# EAGLE design femtoduinoUSB (EAGLE 6.5.0)
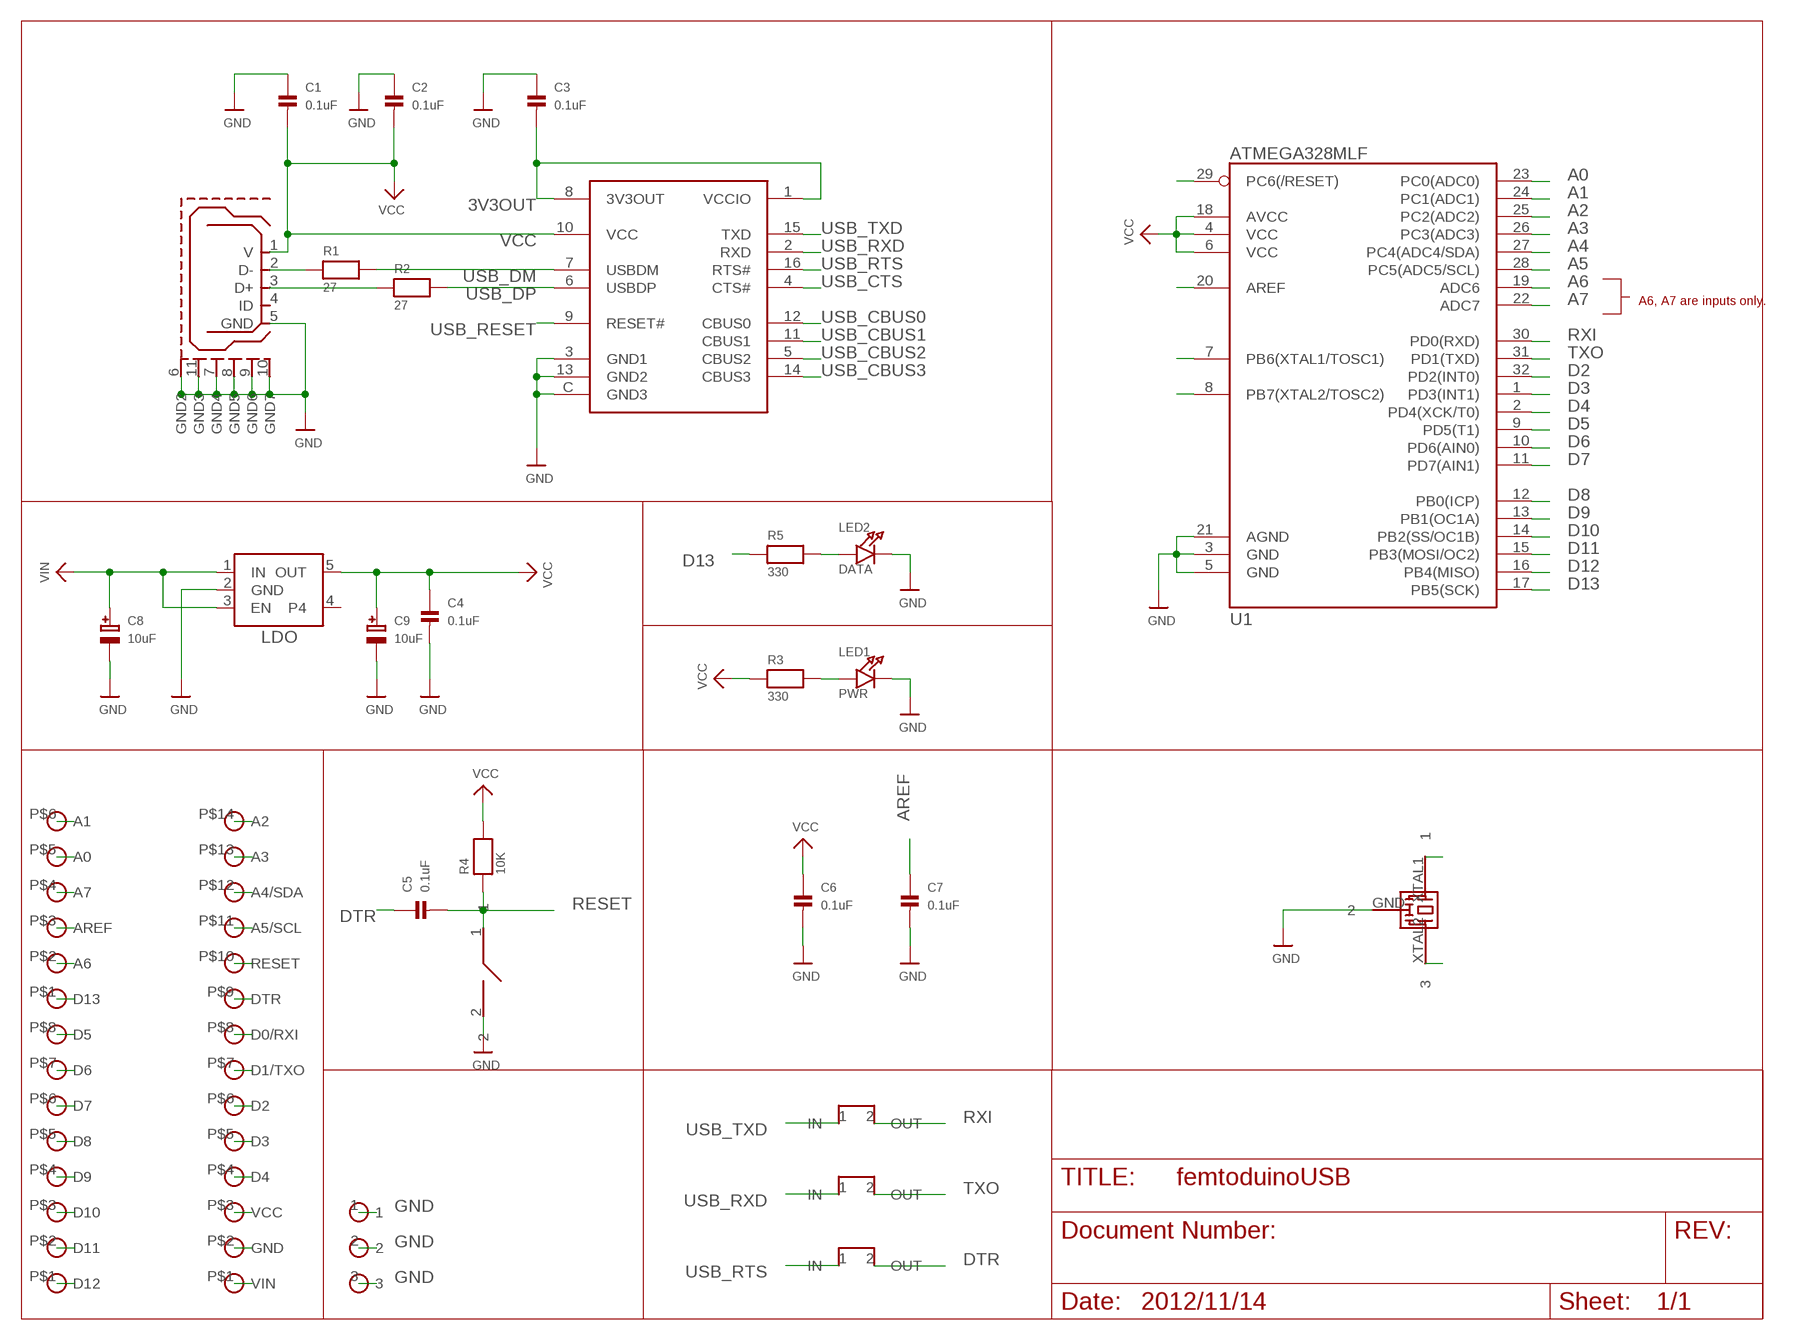
[diagram p0: schematic, sheet 1]
FRAME1 (LETTER_L): LAST_DATE_TIME: 2012/11/14

## Parts
C1  0.1uF  CAP_CERAMIC_0402  [_0402]
C2  0.1uF  CAP_CERAMIC_0402  [_0402]
C3  0.1uF  CAP_CERAMIC_0402  [_0402]
C4  0.1uF  CAP_CERAMIC_0402MP  [_0402MP]
C5  0.1uF  CAP_CERAMIC_0402MP  [_0402MP]
C6  0.1uF  CAP_CERAMIC_0402MP  [_0402MP]
C7  0.1uF  CAP_CERAMIC_0402  [_0402]
C8  10uF  CAP_TANTALUMA/3216_REFLOW  [EIA3216-18/A-R]
C9  10uF  CAP_TANTALUMA/3216_REFLOW  [EIA3216-18/A-R]
LED1  PWR  LED0603_NOOUTLINE  [CHIPLED_0603_NOOUTLINE]
LED2  DATA  LED0603_NOOUTLINE  [CHIPLED_0603_NOOUTLINE]
R1  27  RESISTOR_0402  [_0402]
R2  27  RESISTOR_0402  [_0402]
R3  330  RESISTOR_0402MP  [_0402MP]
R4  10K  RESISTOR_0402  [_0402]
R5  330  RESISTOR_0402  [_0402]
U1  ATMEGA328MLF  ATMEGA168MLF  [MLF32]
U$1  FT230XQ  [FT230XQ]
U$2  05_PINHEAD_1X6  [05_PINHEAD_1X6_PACKAGE]
U$3  05_PINHEAD_1X8  [05_PINHEAD_1X8_PACKAGE]
U$4  05_PINHEAD_1X14  [05_PINHEAD_1X14_PACKAGE]
U$6  USB_MICROB  [USB_MICROB_PACKAGE]
U$10  LDO_REGULATOR  [LDO_REGULATOR]
U$17  SPST_SMD  [SPST_SMD]
U$22  CSTCE16MOV51-RO  [CSTCE16M0V51-RO_PACKAGE]
U$25  SPST_SMD_CLOSED  [SPST_SMD_CLOSED]
U$26  SPST_SMD_CLOSED  [SPST_SMD_CLOSED]
U$27  SPST_SMD_CLOSED  [SPST_SMD_CLOSED]
U$28  05_PINHEAD_HEADER_1X3  [05_PINHEAD_1X3_HEAD_PACKAGE]

## Nets
3V3OUT: C3.2 U$1.1(VCCIO) U$1.8(3V3OUT)
A0: U1.23(PC0(ADC0)) U$2.P$5(A0)
A1: U1.24(PC1(ADC1)) U$2.P$6(A1)
A2: U1.25(PC2(ADC2)) U$4.P$14(A2)
A3: U1.26(PC3(ADC3)) U$4.P$13(A3)
A4: U1.27(PC4(ADC4/SDA)) U$4.P$12(A4/SDA)
A5: U1.28(PC5(ADC5/SCL)) U$4.P$11(A5/SCL)
A6: U1.19(ADC6) U$2.P$2(A6)
A7: U1.22(ADC7) U$2.P$4(A7)
AREF: C7.1 U1.20(AREF) U$2.P$3(AREF)
D2: U1.32(PD2(INT0)) U$4.P$6(D2)
D3: U1.1(PD3(INT1)) U$4.P$5(D3)
D4: U1.2(PD4(XCK/T0)) U$4.P$4(D4)
D5: U1.9(PD5(T1)) U$3.P$8(D5)
D6: U1.10(PD6(AIN0)) U$3.P$7(D6)
D7: U1.11(PD7(AIN1)) U$3.P$6(D7)
D8: U1.12(PB0(ICP)) U$3.P$5(D8)
D9: U1.13(PB1(OC1A)) U$3.P$4(D9)
D10: U1.14(PB2(SS/OC1B)) U$3.P$3(D10)
D11: U1.15(PB3(MOSI/OC2)) U$3.P$2(D11)
D12: U1.16(PB4(MISO)) U$3.P$1(D12)
D13: R5.1 U1.17(PB5(SCK)) U$2.P$1(D13)
DTR: C5.1 U$4.P$9(DTR) U$27.2(OUT)
GND: C1.1 C2.1 C3.1 C4.2 C6.2 C7.2 C8.- C9.- LED1.C LED2.C U1.3(GND) U1.5(GND) U1.21(AGND) U$1.3(GND1) U$1.13(GND2) U$1.C(GND3) U$4.P$2(GND) U$6.5(GND) U$6.6(GND2) U$6.7(GND4) U$6.8(GND5) U$6.9(GND6) U$6.10(GND7) U$6.11(GND3) U$10.2(GND) U$17.2 U$22.GND U$28.1 U$28.2 U$28.3
N$1: R1.1 U$6.2(D-)
N$2: R2.1 U$6.3(D+)
N$3: LED2.A R5.2
N$8: LED1.A R3.2
RESET: C5.2 R4.1 U1.29(PC6(/RESET)) U$4.P$10(RESET) U$17.1
RXI: U1.30(PD0(RXD)) U$4.P$8(D0/RXI) U$25.2(OUT)
TXO: U1.31(PD1(TXD)) U$4.P$7(D1/TXO) U$26.2(OUT)
USB_CBUS0: U$1.12(CBUS0)
USB_CBUS1: U$1.11(CBUS1)
USB_CBUS2: U$1.5(CBUS2)
USB_CBUS3: U$1.14(CBUS3)
USB_CTS: U$1.4(CTS#)
USB_DM: R1.2 U$1.7(USBDM)
USB_DP: R2.2 U$1.6(USBDP)
USB_RESET: U$1.9(RESET#)
USB_RTS: U$1.16(RTS#) U$27.1(IN)
USB_RXD: U$1.2(RXD) U$26.1(IN)
USB_TXD: U$1.15(TXD) U$25.1(IN)
VCC: C1.2 C2.2 C4.1 C6.1 C9.+ R3.1 R4.2 U1.4(VCC) U1.6(VCC) U1.18(AVCC) U$1.10(VCC) U$4.P$3(VCC) U$6.1(V) U$10.5(OUT)
VIN: C8.+ U$4.P$1(VIN) U$10.1(IN) U$10.3(EN)
XTAL1: U1.7(PB6(XTAL1/TOSC1)) U$22.XTAL1
XTAL2: U1.8(PB7(XTAL2/TOSC2)) U$22.XTAL2
Unconnected: U$6.4(ID) U$10.4

## Notes on the sheet
- A6, A7 are inputs only.

## Library data of the parts
C1-C7 = microbuilder:CAP_CERAMIC: Ceramic Capacitors 0402 - 0402 Surface Mount Capacitors 16pF 50V 5% [Digikey: 445-4899-2-ND] 18pF 50V 5% [Digikey: 490-1281-2-ND] 22pF 50V 5% [Digikey: 490-1283-2-ND] 68pF 50V 5% [Digikey: 490-1289-2-ND] 0.1uF 10V 10% [Digikey: 490-1318-2-ND] 1.0uF 6.3V 10% [Digikey: 490-1320-2-ND] 0603 - 0603 Surface Mount Capacitors 16 pF 50V 5% [Digikey: 445-5051-2-ND] 22 pF 50V [Digikey: PCC220ACVTR-ND] 33 pF 50V 5% [Digikey: 490-1415-1-ND] 56pF 50V 5% [Digikey: 490-1421-1-ND] 220pF 50V 5% [Digikey: 445-1285-1-ND] 680 pF 50V 2200 pF 50V 5% C0G [Digikey: 445-1297-1-ND] 5600 pF 100V 5% X7R [Digikey: 478-3711-1-ND] 0.1 µF 25V 10% [Digikey: PCC2277TR-ND] 0.22 µF 16V 10% X7R [Digikey: 445-1318-1-ND] 1.0 µF 25V 10% [Digikey: 445-5146-2-ND] 0603 - RF Specific 3pF 250V +/-0.1pF RF [Digikey: 712-1347-1-ND] 18 pF 250V 5% [Digikey: 478-3505-1-ND or 712-1322-1-ND] 56 pF 250V 5% C0G RF [Digikey: 490-4867-1-ND] 68 pF 250V RF [Digikey: 490-4868-1-ND] 0805 - 0805 Surface Mount Capacitors 220 pF 250V 2% RF Ceramic Capacitor [Digikey: 712-1398-1-ND] 1000 pF 50V 2% NP0 Ceramic Capacitor [Digikey: 478-3760-1-ND] 0.1 µF 25V 10% Ceramic Capacitor [Digikey: PCC1828TR-ND] 1.0 µF 16V 10% Ceramic Capacitor[Digikey: 490-1691-2-ND] 10.0 µF 10V 10% Ceramic Capacitor[Digikey: 709-1228-1-ND] 10.0 uF 16V 10% Ceramic Capacitor [Digikey: 478-5165-2-ND] 47 uF 6.3V 20% Ceramic Capacitor [Digikey: 587-1779-1-ND or 399-5506-1-ND] 1206 - 1206 Surface Mount Capacitors 47uF 10V 20% Ceramic Capacitor [Digikey: 490-5528-1-ND or 399-5508-1-ND or 445-6010-1-ND] 100uF 6.3V -20%, +80% Y5V Ceramic Capacitor (Digikey: 490-4512-1-ND, Mouser: 81-GRM31CF50J107ZE1L)
C8 C9 = microbuilder:CAP_TANTALUM: Tantalum Capacitors Wave footprints have larger pads and are meant to be used for hand soldering. Reflow footprints are optimised for solder paste and a reflow oven. EIA3216-18/A-[R/W] - Size A / 3216-18 / 1206 footprint 4.7µF 25V 10% Tantalum Capacitor 10µF 16V 10% Tantalum Capacitor [Digikey: 495-2236-2-ND] EIA3528-21/B-[R/W] - Size B / 3528-21 47µF 10V 10% Tantalum Capactior [Digikey: 495-2216-1-ND] EIA6032-28/C-[R/W] - Size C / 6032-28 10µF 35V 20% Tantalum Capacitor [Digikey: 495-2285-1-ND] 100µF 16V 10% Tantalum Capactior [Digikey: 399-5214-1-ND]
LED1 LED2 = microbuilder:LED: LED 0603 - 0603 Surface Mount Package 2mA: Green LED - Low Power (3.9mcd, 2ma, 1.7Vf) - Digikey: 475-2709-2-ND Orange LED - Low Power (9.8mcd, 2ma, 1.8Vf) - Digikey: 475-1194-2-ND Red LED - Low Power (5mcd, 2ma, 1.8Vf) - Digikey: 475-1195-2-ND Yellow LED - Low Power (7mcd, 2ma, 1.8Vf) - Digikey: 475-1196-2-ND 5mA: Blue LED - Low Power (17mcd, 5ma, 2.9Vf) - Digikey: LNJ937W8CRACT-ND 0805 - 0805 Surface Mount Package 2mA: Red LED (8.8mcd, 2mA, 1.8Vf, Clear) - Low Power [Digikey: 475-2510-1-ND] Green LED (5mcd, 2mA, 1.8Vf, Clear) - Low Power [Digikey: 475-2730-1-ND] Yellow LED (11.3mcd, 2mA, 1.8Vf, Clear) - Low Power [Digikey: 475-2555-1-ND] 20mA: Red LED (104mcd, 20mA, Diffused) - LS R976 [Digikey: 475-1278-6-ND] Red LED (12mcd, 20mA, 2.0Vf, Clear) - APT2012EC [Digikey: 754-1128-1-ND] Green LED (15mcd, 20mA, 2.2Vf, Clear) - APT2012GC [Digikey: 754-1131-1-ND] Orange LED (160mcd, 20mA, 2.1Vf, Clear) - APT2012SECK [Digikey: 754-1130-1-ND] 1206 - 1206 Surface Mount Package Green LED (26mcd, 20mA, Diffused) - LG N971 [Digikey: 475-1407-6-ND] Red LED (15mcd, 20mA, Diffused) - LH N974 [Digikey: 475-1416-6-ND]
R1-R5 = microbuilder:RESISTOR: Resistors 0402 - 0402 Surface Mount Package 22 Ohm 1% 1/16W [Digikey: 311-22.0LRTR-ND] 33 Ohm 5% 1/16W 1.0K 5% 1/16W 1.5K 5% 1/16W 2.0K 1% 1/16W 10.0K 1% 1/16W [Digikey: 311-10.0KLRTR-ND] 10.0K 5% 1/16W [Digikey: RMCF0402JT10K0TR-ND] 12.1K 1% 1/16W [Digikey: 311-22.0LRTR-ND] 100.0K 5% 1/16W 0603 - 0603 Surface Mount Package 0 Ohm 1/10 Watt 1% Resistor 15 Ohm 1/10 Watt 1% Resistor 33 Ohm 1/10 Watt 1% Resistor 49.9 Ohm 1/10 Watt 1% Resistor 100 Ohm 1/10 Watt 1% Resistor 150 Ohm 1/10 Watt 1% Resistor 240 Ohm 1/10 Watt 1% Resistor 390 Ohm 1/10 Watt 1% Resistor 560 Ohm 1/10 Watt 1% Resistor 680 Ohm 1/10 Watt 1% Resistor 750 Ohm 1/10 Watt 1% Resistor 1.0K Ohm 1/10 Watt 1% Resistor 1.5K Ohm 1/10 Watt 1% Resistor 2.0K Ohm 1/10 Watt 1% Resistor 2.2K Ohm 1/10 Watt 1% Resistor 3.3K Ohm 1/10 Watt 1% Resistor 4.7K Ohm 1/10 Watt 1% Resistor 10.0K Ohm 1/10 Watt 1% Resistor 12.0K Ohm 1/10 Watt 1% Resistor 12.1K Ohm 1/10 Watt 1% Resistor 20.0K Ohm 1/10 Watt 1% Resistor 33.0K Ohm 1/10 Watt 1% Resistor 100.0K Ohm 1/10 Watt 1% Resistor 0805 - 0805 Surface Mount Package 0 Ohm 1/8 Watt 1% Resistor 33 Ohm 1/8 Watt 1% Resistor 100 Ohm 1/8 Watt 1% Resistor 150 Ohm 1/8 Watt 1% Resistor 200 Ohm 1/8 Watt 1% Resistor 240 Ohm 1/8 Watt 1% Resistor 330 Ohm 1/8 Watt 1% Resistor 390 Ohm 1/8 Watt 1% Resistor 470 Ohm 1/8 Watt 1% Resistor 1.0K Ohm 1/8 Watt 1% Resistor 1.5K Ohm 1/8 Watt 1% Resistor 2.0K Ohm 1/8 Watt 1% Resistor 4.7K Ohm 1/8 Watt 1% Resistor 5.1K Ohm 1/8 Watt 1% Resistor 5.6K Ohm 1/8 Watt 1% Resistor 10.0K Ohm 1/8 Watt 1% Resistor 22.0K Ohm 1/8 Watt 1% Resistor 33.0K Ohm 1/8 Watt 1% Resistor 100K Ohm 1/8 Watt 1% Resistor 1206 - 1206 Surface Mount Package 2012 - 2010 Surface Mount Package 0.11 Ohm 1/2 Watt 1% Resistor - Digikey: RHM.11UCT-ND
U1 = SparkFun-DigitalIC:ATMEGA168: Atmel 32-pin 8-bit micro, 16k flash.
U$1 = femtoduino:FT230XQ
U$2 = femtoduino:05_PINHEAD_1X6
U$3 = femtoduino:05_PINHEAD_1X8
U$4 = femtoduino:05_PINHEAD_1X14
U$6 = femtoduino:USB_MICROB: This is the hirose ZX62-B-5PA(11) MICRO-USB B Type female connection.
U$10 = femtoduino:LDO_REGULATOR
U$17 = femtoduino:SPST_SMD
U$22 = femtoduino:CSTCE16MOV51-RO: This is the CSTCE16M0V51-R0 Murata resonator (CERALOCK) 16Mhz 0.5% Tolerance
U$25-U$27 = femtoduino:SPST_SMD_CLOSED
U$28 = femtoduino:05_PINHEAD_HEADER_1X3

## Net classes
0 default: clearance 0.205 mm

## Board
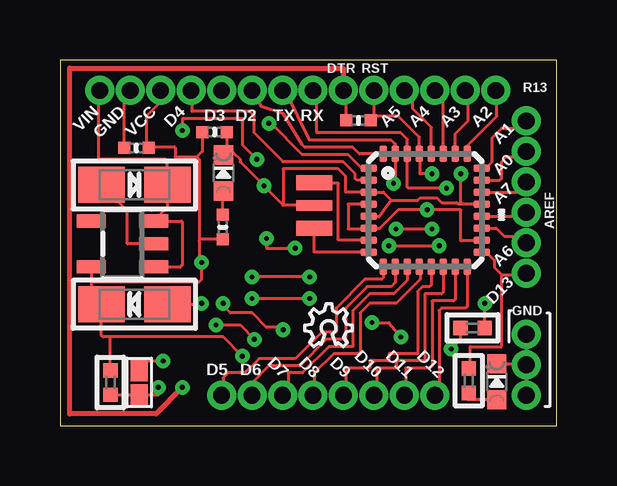
[diagram p1: board, top side]
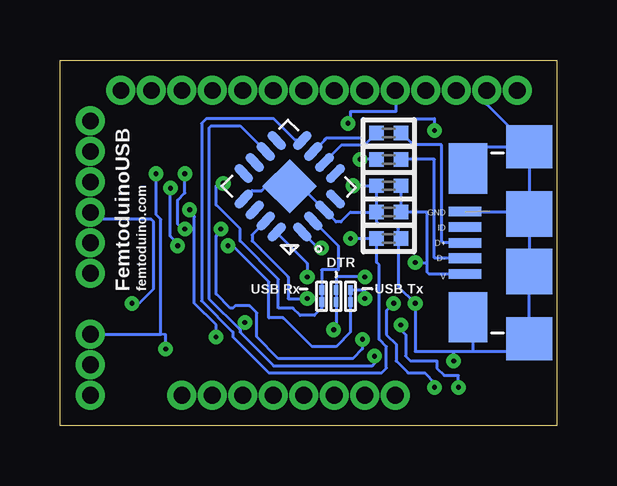
[diagram p2: board, bottom side, seen from below]

Size 20.7 x 15.24 mm. Coordinates in mm from the lower left corner, seen from the top.
Outline: 0,0 20.7,0 20.7,15.24 0,15.24 0,0
Copper layers (1*16): Top 0.035mm / dielectric 1.5mm / Bottom 0.035mm
Design rules "default *": minimum track width 10mil, minimum drill 24mil, track to track 8mil, track to pad 8mil, pad to pad 8mil, via to via 8mil, smd to smd 8mil, copper to edge 40mil, drill to drill 8mil, minimum pad ring 10mil, minimum via ring 8mil, stop-mask expansion 2mil, vias tented up to drill 30mil, thermal gap 10mil

### Footprints (pad centres in the part's own frame; a part is rotated, then mirrored left to right if it is on the bottom)
_0402 = smd 0.6 x 0.6: 1 -0.508,0; 2 0.508,0
_0402MP = smd 0.5 x 0.5: 1 -0.508,0; 2 0.508,0
EIA3216-18/A-R = smd 1.95 x 1.5: + 1.375,0; - -1.375,0
CHIPLED_0603_NOOUTLINE = smd 0.8 x 0.8: A 0,-0.75; C 0,0.75
MLF32 = smd 0.7 x 0.3: 1 -2.35,1.75; 2 -2.35,1.25; 3 -2.35,0.75; 4 -2.35,0.25; 5 -2.35,-0.25; 6 -2.35,-0.75; 7 -2.35,-1.25; 8 -2.35,-1.75; 17 2.35,-1.75; 18 2.35,-1.25; 19 2.35,-0.75; 20 2.35,-0.25; 21 2.35,0.25; 22 2.35,0.75; 23 2.35,1.25; 24 2.35,1.75 | smd 0.3 x 0.7: 9 -1.75,-2.35; 10 -1.25,-2.35; 11 -0.75,-2.35; 12 -0.25,-2.35; 13 0.25,-2.35; 14 0.75,-2.35; 15 1.25,-2.35; 16 1.75,-2.35; 25 1.75,2.35; 26 1.25,2.35; 27 0.75,2.35; 28 0.25,2.35; 29 -0.25,2.35; 30 -0.75,2.35; 31 -1.25,2.35; 32 -1.75,2.35
FT230XQ = smd 0.95 x 0.4: 1 -1.725,0.975; 2 -1.725,0.325; 3 -1.725,-0.325; 4 -1.725,-0.975; 9 1.725,-0.975; 10 1.725,-0.325; 11 1.725,0.325; 12 1.725,0.975 | smd 0.4 x 0.95: 5 -0.975,-1.725; 6 -0.325,-1.725; 7 0.325,-1.725; 8 0.975,-1.725; 13 0.975,1.725; 14 0.325,1.725; 15 -0.325,1.725; 16 -0.975,1.725 | smd 1.6 x 1.6: C 0,0
05_PINHEAD_1X6_PACKAGE = drill 0.7 pad 1.143: P$1 0,0; P$2 0,1.27; P$3 0,2.54; P$4 0,3.81; P$5 0,5.08; P$6 0,6.35
05_PINHEAD_1X8_PACKAGE = drill 0.7 pad 1.143: P$1 0,0; P$2 0,1.27; P$3 0,2.54; P$4 0,3.81; P$5 0,5.08; P$6 0,6.35; P$7 0,7.62; P$8 0,8.89
05_PINHEAD_1X14_PACKAGE = drill 0.7 pad 1.143: P$1 0,0; P$2 0,1.27; P$3 0,2.54; P$4 0,3.81; P$5 0,5.08; P$6 0,6.35; P$7 0,7.62; P$8 0,8.89; P$9 0,10.16; P$10 0,11.43; P$11 0,12.7; P$12 0,13.97; P$13 0,15.24; P$14 0,16.51
USB_MICROB_PACKAGE = smd 0.4 x 1.35: 1 -1.3,-0.68; 2 -0.64,-0.68; 3 0,-0.68; 4 0.66,-0.68; 5 1.3,-0.68 | smd 2.1 x 1.6: 6 -3.1,-0.8; 11 3.1,-0.8 | smd 1.8 x 1.9: 7 -4,-3.35; 10 4,-3.35 | smd 1.9 x 1.9: 8 -1.2,-3.35; 9 1.2,-3.35
LDO_REGULATOR = smd 0.55 x 1.2: 1 -0.95,-1.3; 2 0,-1.3; 3 0.95,-1.3; 4 0.95,1.3; 5 -0.95,1.3
SPST_SMD = smd 0.889 x 0.699: 1 -0.508,0; 2 0.508,0
CSTCE16M0V51-RO_PACKAGE = smd 1.5 x 0.45: GND 0,0.95 | smd 1.5 x 0.62: XTAL1 0,1.9; XTAL2 0,0
SPST_SMD_CLOSED = smd 0.4 x 0.2: 1 -0.25,0; 2 0.25,0
05_PINHEAD_1X3_HEAD_PACKAGE = drill 0.7 pad 1.016: 1 0,0; 2 0,-1.27; 3 0,-2.54

### Placement (x,y rotation side)
C1  7,10 0 bottom
C2  7,8.9 0 bottom
C3  7,7.8 180 bottom
C4  6.44,12.24 0 top
C5  12.43,12.72 0 top
C6  3.18,11.58 180 top
C7  17.19,4.08 180 top
C8  3.1,10.04 0 top
C9  3.1,5.06 180 top
LED1  6.81,10.53 0 top
LED2  18.2,1.83 0 top
R1  7,11.1 180 bottom
R2  7,12.2 180 bottom
R3  6.78,8.28 90 top
R4  2.1,1.8 90 top
R5  17.03,1.88 270 top
U1  15.22,8.98 0 top
U$1  11.14,9.98 135 bottom
U$2  19.43,6.35 0 top
U$3  15.62,1.27 90 top
U$4  1.65,13.97 270 top
U$6  4.5,7.62 90 bottom
U$10  2.6,7.58 90 top
U$17  3.3,1.8 90 top
U$22  10.59,8.23 0 top
U$25  8.6,5.4 270 bottom
U$26  9.8,5.4 270 bottom
U$27  9.2,5.4 270 bottom
U$28  19.43,1.27 180 top
U$29  [OSHW_6X70_NOTEXT]  10.2,3.3 0 top

### Tracks (layer width: path | path; a pad name or v marks a point on that pad's centre or on a via)
3V3OUT  (via drill 0.2 pad 0.13)
  Top 0.127: v8.6,7.8 8.6,7.4 v9.8,7.4
  Bottom 0.127: U$1.8 10.89,11.89 11.8,12.8 14.6,12.8 14.8,12.6 14.8,5.2 13.5,3.9 13.5,3.7 12,2.2 7.3,2.2 7.1,2.4 7.1,3.3 7.4,3.6 7.4,6.7 7.51,6.81 C3.2 | 10.61,7.99 U$1.1 9.93,7.4 v9.8,7.4 | C3.2 v8.6,7.8 | 7.61,7.61 C3.2
A0
  Top 0.127: U1.23 18.33,10.23 18.4,10.3 18.4,11 18.6,11.2 19.2,11.2 U$2.P$5
A1
  Top 0.127: U1.24 17.73,10.73 18,11 18,12 18.4,12.4 19.13,12.4 U$2.P$6
A2
  Top 0.127: U1.25 16.97,11.67 18.2,12.9 18.2,13.93 U$4.P$14
A3
  Top 0.127: U1.26 16.47,12.17 17,12.7 17,13.86 U$4.P$13
A4
  Top 0.127: U1.27 15.97,13.62 U$4.P$12
A5
  Top 0.127: U1.28 15.47,12.43 14.7,13.2 14.7,13.62 U$4.P$11
A6
  Top 0.127: U1.19 18.17,8.23 18.5,7.9 19.15,7.9 U$2.P$2
A7
  Top 0.127: U1.22 19,9.73 U$2.P$4
AREF  (via drill 0.2 pad 0.13)
  Top 0.127: C7.1 v17.7,5.1 | U1.20 19.27,8.73 U$2.P$3
  Bottom 0.127: U$2.P$3 19.14,8.6 16.9,8.6 16.8,8.5 16.8,5.7 17.4,5.1 v17.7,5.1
D2
  Top 0.127: U1.32 12.47,11.33 12.2,11.6 10.2,11.6 10.1,11.7 9.3,13 8.4,13.3 U$4.P$6
D3  (via drill 0.2 pad 0.13)
  Top 0.127: U1.1 12.57,10.73 12,11.3 10.1,11.3 8.8,12.6 v8.7,12.6
  Bottom 0.127: U$4.P$5 6.7,13.94 6.7,13.1 8.6,13.1 8.6,12.7 v8.7,12.6
D4
  Top 0.127: U1.2 12.37,10.23 12.3,10.3 12.3,10.5 11.8,11 9.3,11 8.1,12.2 8.1,12.9 7.9,13.1 5.5,13.1 5.5,13.93 U$4.P$4
D5
  Top 0.127: U1.9 13.47,6.17 13.4,6.1 12.7,6.1 11.5,4.9 11.5,3.9 10.9,3.9 9.8,2.8 8.3,2.8 7.7,2.2 7,2.2 6.8,2 6.8,1.34 U$3.P$8
D6
  Top 0.127: U1.10 13.97,5.97 13.8,5.8 12.8,5.8 11.9,4.9 11.9,3.6 11.1,3.6 10,2.5 8.7,2.5 8,1.8 U$3.P$7
D7
  Top 0.127: U1.11 14.47,6.07 13.9,5.5 12.9,5.5 12.2,4.8 12.2,3.3 11.2,3.3 10.1,2.2 9.5,2.2 9.5,1.5 U$3.P$6
D8
  Top 0.127: U1.12 15,6.63 15,6.1 14,5.1 12.9,5.1 12.5,4.7 12.5,3 11.4,3 10.6,2.2 10.6,1.33 U$3.P$5
D9
  Top 0.127: U1.13 15.47,5.87 15.4,5.8 15.1,5.8 14.9,5.6 14.9,3 13.7,3 13.7,2.7 12.9,2.7 12.9,2.4 12,2.4 11.9,2.3 11.9,1.36 U$3.P$4
D10
  Top 0.127: U1.14 15.97,5.57 15.9,5.5 15.2,5.5 15.2,2.7 14,2.7 14,2.4 13.2,2.4 13.2,1.39 U$3.P$3
D11
  Top 0.127: U1.15 16.47,5.27 16.4,5.2 15.5,5.2 15.5,2.5 15.4,2.4 14.4,2.4 14.4,1.32 U$3.P$2
D12
  Top 0.127: U1.16 16.97,4.97 16.9,4.9 15.9,4.9 15.8,4.8 15.8,1.45 U$3.P$1
D13
  Top 0.127: R5.1 17.1,2.39 17.1,3.3 18.4,3.3 18.4,6.3 | 18.4,6.3 19.43,6.3 U$2.P$1 | U1.17 17.77,7.23 18.1,6.9 18.1,6.6 18.4,6.3
DTR  (via drill 0.2 pad 0.13)
  Top 0.127: C5.1 11.92,13.86 U$4.P$9 | v9.3,4 9.2,4.1 8.6,4.1 8,4.7 7.1,4.7 6.8,5 v6.8,5.1 | 11.8,14.9 11.81,14.89
  Top 0.2: v5.1,1.6 4,0.5 0.4,0.5 0.4,14.9 11.8,14.9 | 11.81,14.89 U$4.P$9
  Bottom 0.127: U$27.2 9.2,4.1 v9.3,4 | v6.8,5.1 7.1,4.8 7.1,3.8 6.7,3.4 6.7,2.7 6.2,2.2 5.5,2.2 5.1,1.8 v5.1,1.6
GND  (via drill 0.2 pad 0.13)  (1 unrouted)
  Top 0.127: U$10.2 2.82,7.58 2.8,7.6 2.8,8.96 C8.- | v5.9,5.1 5.9,5.06 C9.- 4.04,5.06 | U$28.3 U$28.2 | U$28.2 U$28.1 | LED2.C 19.43,2.58 U$28.2 | U1.21 16.6,9.23 | 13.8,9.4 13.3,8.7 12.87,8.7 U1.5 | U$22.GND 9.3,9.18 | 9.3,9.18 8.72,9.78 v8.5,10 7.5,11 7.5,11.1 7.22,11.38 LED1.C 6.95,11.42 C4.2 | C7.2 16.68,3.58 v16.3,3.2 | 9.3,9.18 9.3,10.7 11.6,10.7 11.9,10.4 11.9,9.73 U1.3 13.47,9.73 13.8,9.4 | v4.3,2.7 3.3,2.7 U$17.2 | C6.2 2.67,13.52 U$4.P$2 | 13.8,9.4 14.9,9.4 15,9.5 15.7,9.5 15.9,9.3 16.53,9.3 16.6,9.23 | 16.6,9.23 16.7,9.33 v16.7,10.5
  Bottom 0.127: U$4.P$2 2.92,13.39 U$6.10 | U$6.10 U$6.9 | U$6.5 1.25,8.92 U$6.9 | U$6.9 U$6.8 U$6.7 1.15,3.1 3.5,3.1 | 4.3,3.1 5.9,3.1 v5.9,5.1 6.6,5.8 6.6,7.8 | 4.3,3.1 3.5,3.1 | C3.1 6.6,7.8 | 6.6,7.8 6.6,8.2 6.7,8.3 7,8.3 7.1,8.4 7.4,8.4 7.51,8.51 C2.1 | C2.1 C1.1 v8.5,10 | C2.1 8.6,8.9 9,8.5 9.2,8.5 U$1.3 10.68,9.98 U$1.C 12.12,9.98 12.3,9.8 12.7,9.8 U$1.13 | U$6.6 3.5,4.52 3.5,3.1 | U$6.11 3.7,11.62 U$6.10 | U$28.3 16.5,3.81 | 16.5,3.81 16.5,8.6 16.7,8.8 v16.7,10.5 | v16.3,3.2 16.3,3.8 16.5,3.81 | v4.3,2.7 4.3,3.1
N$1
  Bottom 0.127: U$6.2 5.08,6.98 5.1,7 5.1,11.1 R1.1
N$2
  Bottom 0.127: U$6.3 4.72,7.62 4.8,7.7 4.8,11.7 5.99,11.7 R2.1
N$3
  Top 0.127: LED2.A 17.03,1.08 R5.2
N$8
  Top 0.127: R3.2 6.78,9.85 LED1.A
RESET  (via drill 0.2 pad 0.13)
  Top 0.127: U$4.P$10 13.08,12.86 C5.2 13.12,12.9 14.1,12.9 14.97,12.03 U1.29 15,11.3 15,10.5 v15.5,10.5 | R4.1 U$17.1 4.1,1.29 v4.1,1.6 | v6.5,4.2 7.5,4.2 v8.1,3.6 | v14,8.2 v15.5,8.2
  Bottom 0.127: v8.1,3.6 8.1,3.2 8.5,2.8 11.6,2.8 12.5,3.7 12.5,4.7 12.8,5 13.4,5 13.5,4.9 13.6,4.9 14.2,5.5 14.2,7.9 v14,8.2 | v15.5,8.2 15.6,8.2 15.8,8.4 15.8,9.4 15.5,9.7 v15.5,10.5 | v6.5,4.2 6.5,4 6.3,3.8 6.3,2.9 6.1,2.7 5,2.7 5,2.4 4.7,2.1 4.1,2.1 v4.1,1.6
RXI  (via drill 0.2 pad 0.13)
  Top 0.127: U$4.P$8 10.7,13.81 10.7,12.2 14.2,12.2 14.47,11.93 U1.30 14.47,9.93 14.5,9.9 v16.1,9.9 | v13.7,7.5 v15.8,7.5
  Bottom 0.127: U$25.2 8.6,3.9 9.2,3.3 10.2,3.3 11.4,4.5 12,4.5 12,6 13.5,7.5 v13.7,7.5 | v15.8,7.5 15.8,7.6 16.1,7.9 v16.1,9.9
TXO  (via drill 0.2 pad 0.13)
  Top 0.127: U$4.P$7 9.4,13.94 10.4,11.9 13.8,11.9 13.97,11.73 U1.31 13.97,10.17 v13.9,10.1
  Bottom 0.127: U$26.2 9.8,4.9 10.1,4.6 10.7,4.6 11,4.9 11.6,4.9 11.6,6.1 13.2,7.7 13.2,8.2 14.2,9.2 14.2,10 14,10 v13.9,10.1
USB_DM  (via drill 0.2 pad 0.13)
  Top 0.127: v8.2,11.1 7.6,11.7 7.6,12.8 5.1,12.8 v5.1,12.3
  Bottom 0.127: R1.2 v8.2,11.1 | U$1.7 9.68,11.9 9.68,11.92 9.6,12 8.1,12 8.1,12.8 5.1,12.8 v5.1,12.3
USB_DP
  Bottom 0.127: U$1.6 8.96,11.7 8.01,11.7 R2.2
USB_RTS  (via drill 0.2 pad 0.13)
  Top 0.127: v10.4,6.2 v8,6.2
  Bottom 0.127: v8,6.2 9.2,6.2 U$27.1 | U$1.16 11.67,8.03 10.4,6.77 v10.4,6.2
USB_RXD
  Bottom 0.127: U$1.2 10.05,8.45 9.1,7.5 9.1,6.5 9.8,6.5 U$26.1
USB_TXD  (via drill 0.2 pad 0.13)
  Top 0.127: v10.4,5.3 v8,5.3
  Bottom 0.127: v8,5.3 8,5.65 U$25.1 | U$1.15 12.7,7.96 12.7,7.7 11.2,6.2 11.2,5.3 v10.4,5.3
VCC  (via drill 0.2 pad 0.13)
  Top 0.127: U$10.5 1.3,6 | 1.3,6 1.3,5.49 C9.+ 1.73,3.77 1.8,3.7 2.1,3.7 | 5.7,11.2 4.8,11.2 4.8,11.6 3.69,11.6 C6.1 | 5.7,11.2 5.8,11.1 5.8,7.7 | 5.8,7.7 5.8,6.9 v5.9,6.8 5.9,6.1 5.8,6 1.3,6 | v7.6,2.9 6.8,3.7 2.1,3.7 | v13,4.3 13.7,4.3 v14.2,3.7 | U1.18 17.54,7.7 16.7,7.7 16.7,9 v15.3,9 14.1,9 13.33,8.23 U1.6 12.84,8.2 12,8.2 12,9.23 U1.4 | R4.2 2.1,3.7 | R3.1 5.87,7.77 5.8,7.7 | C6.1 3.81,11.6 | U$4.P$3 4.19,13.49 3.6,12.9 3.6,11.67 C6.1 | C4.1 5.93,11.43 5.7,11.2
  Bottom 0.127: U$6.1 5.32,6.32 5.4,6.4 5.4,6.8 | 5.4,6.8 5.4,8.9 C2.2 C1.2 | v5.9,6.8 5.4,6.8 | 13.2,4 13.2,4.1 v13,4.3 | 13.2,4 13.2,3.9 11.8,2.5 7.7,2.5 7.6,2.6 v7.6,2.9 | U$1.10 13.2,12.5 14.4,12.5 14.5,12.4 14.5,5.3 13.2,4 | v14.2,3.7 14.2,4.2 15.1,5.1 15.1,8.7 v15.3,9
VIN
  Top 0.127: U$4.P$1 1.65,13.95 1.6,13.9 1.6,11.1 4.4,11.1 4.47,11.03 C8.+ 4.47,9.11 U$10.3 5.07,8.53 5.1,8.5 5.1,6.7 5,6.6 3.93,6.6 U$10.1
XTAL1
  Top 0.127: U1.7 11.6,7.73 11.6,10.1 10.59,10.1 U$22.XTAL1
XTAL2
  Top 0.127: U1.8 10.59,7.23 U$22.XTAL2

### Text on the board
tNames: DTR | RST | R13 | VIN | GND | VCC | D4 | D3 | D2 | TX | RX | A5 | A4 | A3 | A2 | A1 | A0 | A7 | A6 | AREF | D13 | GND | D5 | D6 | D7 | D8 | D9 | D10 | D11 | D12
bNames: DTR | USB Tx | USB Rx | femtoduino.com | FemtoduinoUSB